# Altium schematic sheet CoG_IHM.SchDoc
size A3; Author: Audran; CompanyName: Goldorak; Address1: Electrolab; Address2: 52 rue Paul Lescop; Address3: 92000 Nanterre; ProjectName: Cartes_2017
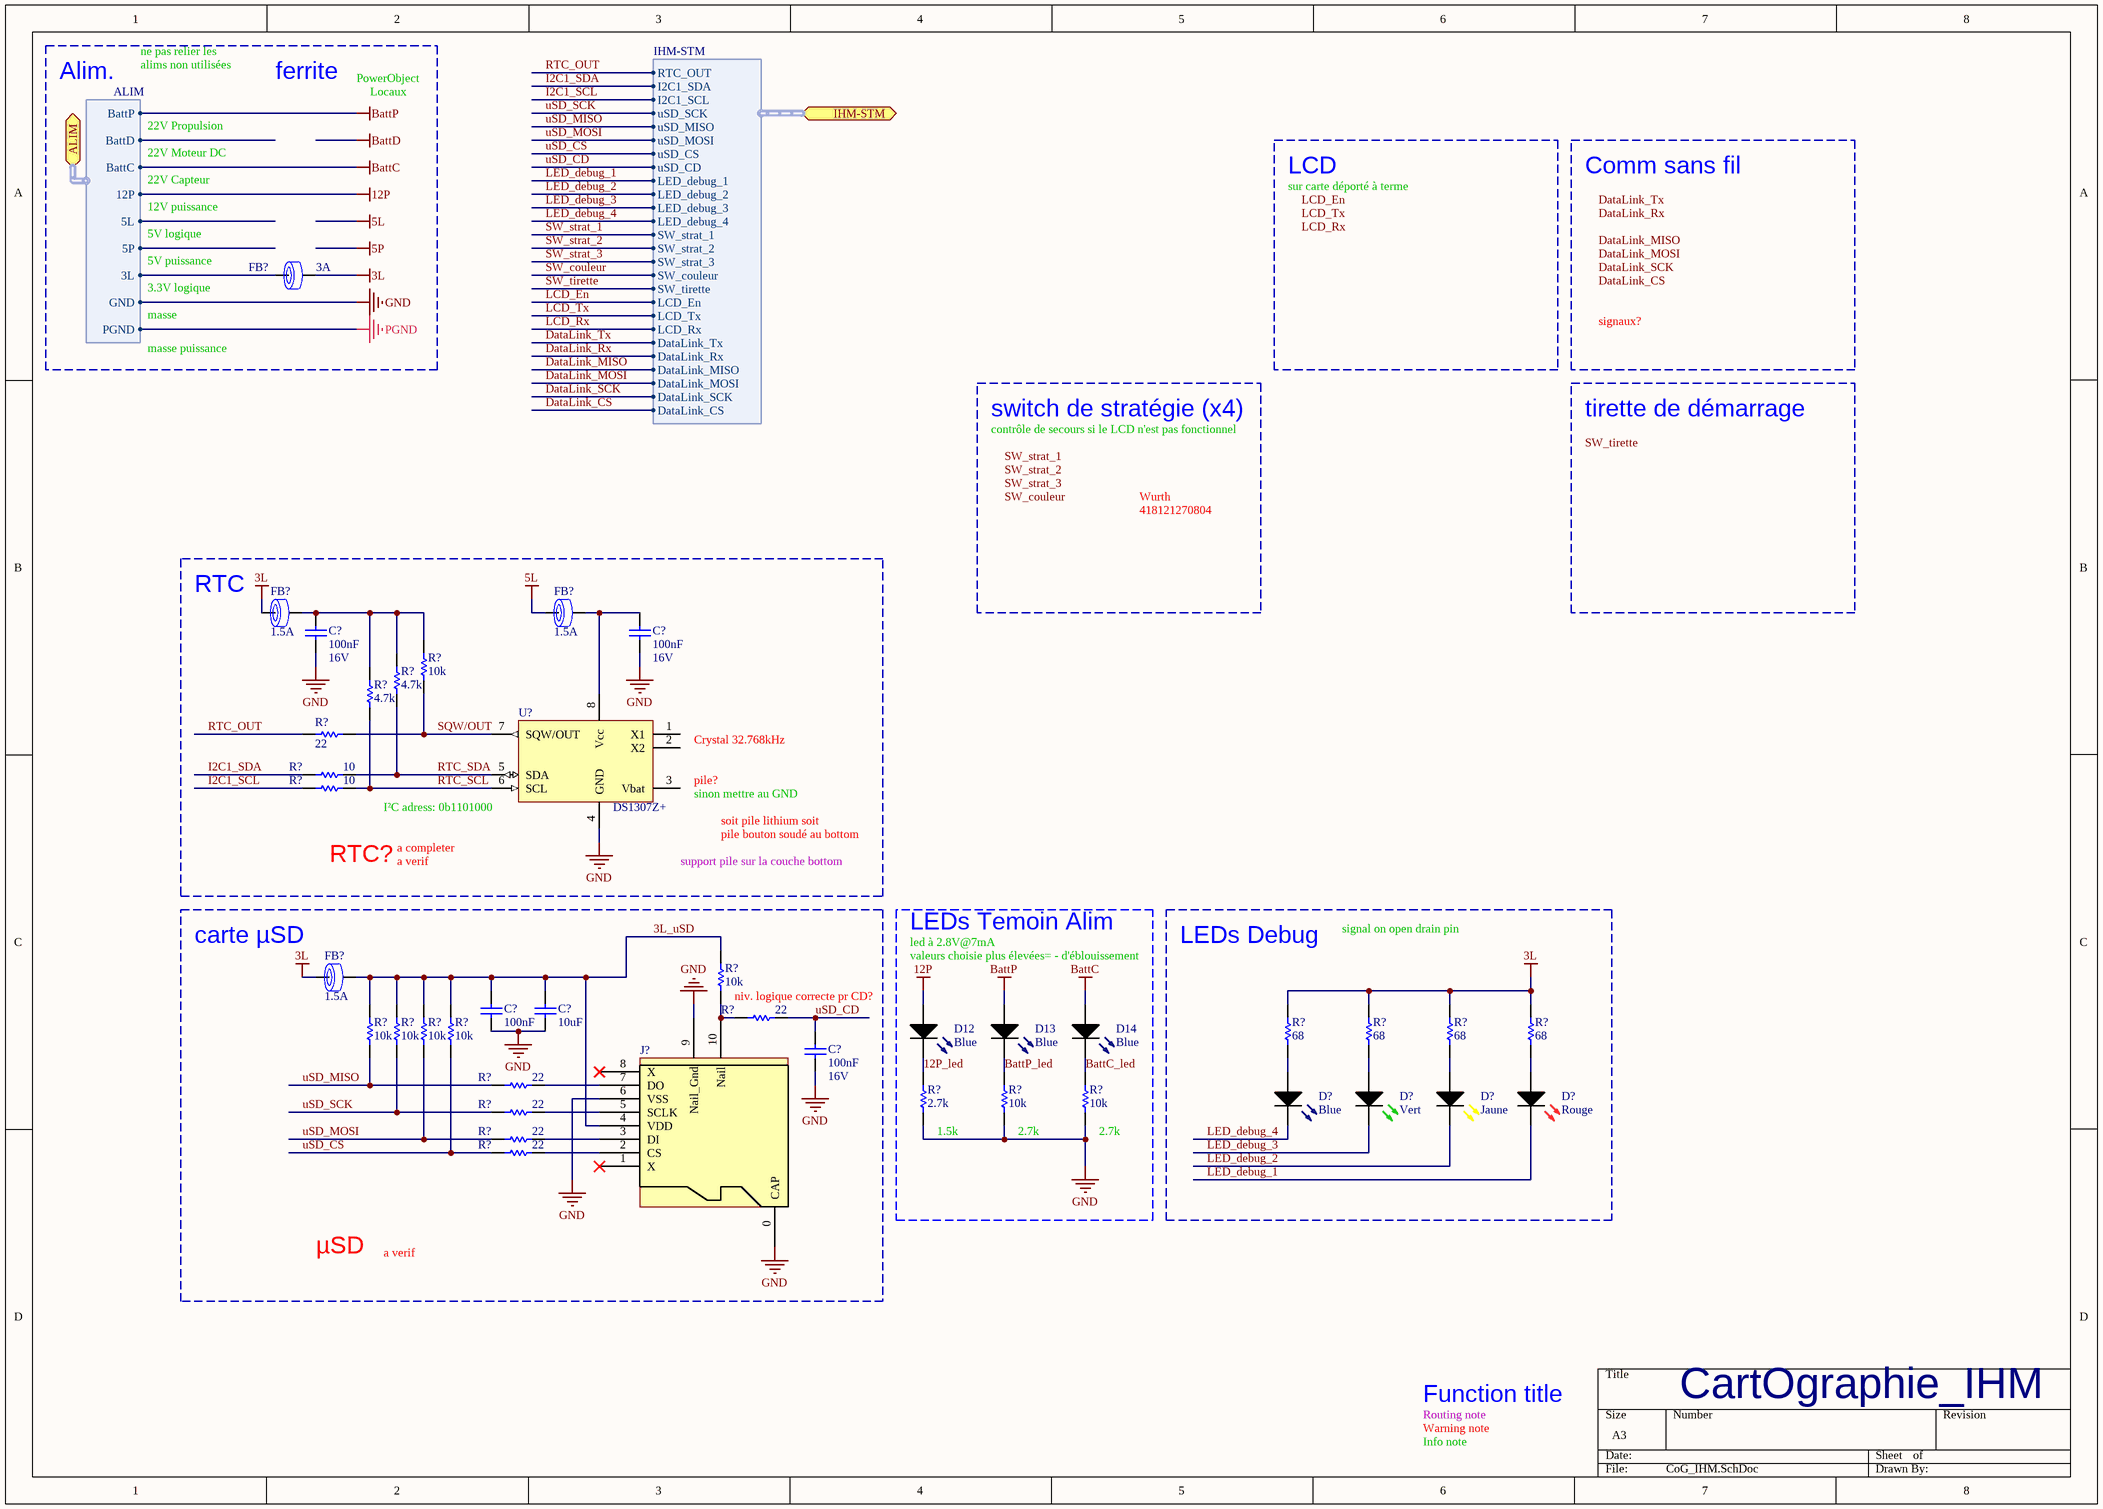
[diagram p0: CoG_IHM.SchDoc]

## Parts
(Parts that share a designator on the sheet are numbered #1, #2 ... from top to bottom, then left to right.)
C?#1  100nF  RatedVoltage: 16V  [WCAP-CSGP_0402, 1x0.5x0.5]
C?#2  100nF  RatedVoltage: 16V  [WCAP-CSGP_0402, 1x0.5x0.5]
C?#3  100nF  [WCAP-CSGP_0402, 1x0.5x0.5]
C?#4  10uF  [WCAP-CSGP_0805, 2x1.25x1.25]
C?#5  100nF  RatedVoltage: 16V  [WCAP-CSGP_0402, 1x0.5x0.5]
D12  Blue  [0603]
D13  Blue  [0603]
D14  Blue  [0603]
D?#1  Blue  [0603]
D?#2  Vert  [0603 - MIXTE]
D?#3  Jaune  [0603]
D?#4  Rouge  [0603]
FB?#1  RatedCurrent: 3A  [WE-CBF_0805_High Current]  (hidden comment: 742792023)
FB?#2  RatedCurrent: 1.5A  [WE-CBF_0603_High Current]  (hidden comment: 742792624)
FB?#3  RatedCurrent: 1.5A  [WE-CBF_0603_High Current]  (hidden comment: 742792624)
FB?#4  RatedCurrent: 1.5A  [WE-CBF_0603_High Current]  (hidden comment: 742792624)
J?  5027740891  [MOLEX_MICRO_SD_HEADER_5027740891]  (value not drawn)
R?#1  value 10k  [RESC1005X04N]  (hidden comment: RC0402FR-0710KL)
R?#2  value 4.7k  [RESC1005X04N]
R?#3  value 4.7k  [RESC1005X04N]
R?#4  value 22  [RESC1005X04N]  (hidden comment: RC0402FR-0722RL)
R?#5  value 10  [RESC1005X04N]  (hidden comment: RC0402FR-0710RL)
R?#6  value 10  [RESC1005X04N]  (hidden comment: RC0402FR-0710RL)
R?#7  value 10k  [RESC1005X04N]  (hidden comment: RC0402FR-0710KL)
R?#8  value 68  [RESC1608X06N]  (hidden comment: RC0603FR-0768RL)
R?#9  value 68  [RESC1608X06N]  (hidden comment: RC0603FR-0768RL)
R?#10  value 68  [RESC1608X06N]  (hidden comment: RC0603FR-0768RL)
R?#11  value 68  [RESC1608X06N]  (hidden comment: RC0603FR-0768RL)
R?#12  value 22  [RESC1005X04N]  (hidden comment: RC0402FR-0722RL)
R?#13  value 10k  [RESC1005X04N]  (hidden comment: RC0402FR-0710KL)
R?#14  value 10k  [RESC1005X04N]  (hidden comment: RC0402FR-0710KL)
R?#15  value 10k  [RESC1005X04N]  (hidden comment: RC0402FR-0710KL)
R?#16  value 10k  [RESC1005X04N]  (hidden comment: RC0402FR-0710KL)
R?#17  value 22  [RESC1005X04N]  (hidden comment: RC0402FR-0722RL)
R?#18  value 22  [RESC1005X04N]  (hidden comment: RC0402FR-0722RL)
R?#19  value 2.7k  [RESC2012X06M]  (hidden comment: RC0805FR-072K7L)
R?#20  value 10k  [RESC1608X06N]  (hidden comment: RC0603FR-0710KL)
R?#21  value 10k  [RESC1608X06N]  (hidden comment: RC0603FR-0710KL)
R?#22  value 22  [RESC1005X04N]  (hidden comment: RC0402FR-0722RL)
R?#23  value 22  [RESC1005X04N]  (hidden comment: RC0402FR-0722RL)
U?  DS1307Z+

## Blocks framed on the sheet
LEDs Temoin Alim: D12-D14 R?#19-R?#21
LEDs Debug: D?#1-D?#4 R?#8-R?#11

## Ports
ALIM (harness ALIM), IHM-STM (harness IHM-STM)

## Harnesses
IHM-STM: RTC_OUT, I2C1_SDA, I2C1_SCL, uSD_SCK, uSD_MISO, uSD_MOSI, uSD_CS, uSD_CD, LED_debug_1, LED_debug_2, LED_debug_3, LED_debug_4, SW_strat_1, SW_strat_2, SW_strat_3, SW_couleur, SW_tirette, LCD_En, LCD_Tx, LCD_Rx, DataLink_Tx, DataLink_Rx, DataLink_MISO, DataLink_SCK, DataLink_MOSI, DataLink_CS
ALIM: BattP, BattD, BattC, 12P, 5L, 5P, 3L, GND, PGND

## Nets
3L: FB?#1.2 FB?#2.1 FB?#4.1 R?#8.1 R?#9.1 R?#10.1 R?#11.1
5L: FB?#3.1
12P: D12.2(A) ; port ALIM.12P
BattC: D14.2(A) ; port ALIM.BattC
BattP: D13.2(A) ; port ALIM.BattP
GND: C?#1.1 C?#2.1 C?#3.1 C?#4.1 C?#5.1 J?.0(CAP) J?.6(VSS) J?.9(Nail_Gnd) R?#19.1 R?#20.1 R?#21.1 U?.4(GND) ; port ALIM.GND
PGND: port ALIM.PGND
3L_uSD: C?#3.2 C?#4.2 FB?#4.2 J?.4(VDD) R?#7.2 R?#13.2 R?#14.2 R?#15.2 R?#16.2
12P_led: D12.1(C) R?#19.2
BattC_led: D14.1(C) R?#21.2
BattP_led: D13.1(C) R?#20.2
DataLink_CS: port IHM-STM.DataLink_CS
DataLink_MISO: port IHM-STM.DataLink_MISO
DataLink_MOSI: port IHM-STM.DataLink_MOSI
DataLink_Rx: port IHM-STM.DataLink_Rx
DataLink_SCK: port IHM-STM.DataLink_SCK
DataLink_Tx: port IHM-STM.DataLink_Tx
I2C1_SCL: R?#6.1 ; port IHM-STM.I2C1_SCL
I2C1_SDA: R?#5.1 ; port IHM-STM.I2C1_SDA
LCD_En: port IHM-STM.LCD_En
LCD_Rx: port IHM-STM.LCD_Rx
LCD_Tx: port IHM-STM.LCD_Tx
LED_debug_1: D?#4.1(C) ; port IHM-STM.LED_debug_1
LED_debug_2: D?#3.1(C) ; port IHM-STM.LED_debug_2
LED_debug_3: D?#2.1(C) ; port IHM-STM.LED_debug_3
LED_debug_4: D?#1.1(C) ; port IHM-STM.LED_debug_4
RTC_OUT: R?#4.1 ; port IHM-STM.RTC_OUT
RTC_SCL: R?#3.1 R?#6.2 U?.6(SCL)
RTC_SDA: R?#2.1 R?#5.2 U?.5(SDA)
SQW/OUT: R?#1.1 R?#4.2 U?.7(SQW/OUT)
SW_couleur: port IHM-STM.SW_couleur
SW_strat_1: port IHM-STM.SW_strat_1
SW_strat_2: port IHM-STM.SW_strat_2
SW_strat_3: port IHM-STM.SW_strat_3
SW_tirette: port IHM-STM.SW_tirette
uSD_CD: C?#5.2 R?#12.2 ; port IHM-STM.uSD_CD
uSD_CS: R?#16.1 R?#23.1 ; port IHM-STM.uSD_CS
uSD_MISO: R?#13.1 R?#17.1 ; port IHM-STM.uSD_MISO
uSD_MOSI: R?#15.1 R?#22.1 ; port IHM-STM.uSD_MOSI
uSD_SCK: R?#14.1 R?#18.1 ; port IHM-STM.uSD_SCK
NetC?#1_2: C?#1.2 FB?#2.2 R?#1.2 R?#2.2 R?#3.2
NetC?#2_2: C?#2.2 FB?#3.2 U?.8(Vcc)
NetD?#1_2: D?#1.2(A) R?#8.2
NetD?#2_2: D?#2.2(A) R?#9.2
NetD?#3_2: D?#3.2(A) R?#10.2
NetD?#4_2: D?#4.2(A) R?#11.2
NetFB?#1_1: FB?#1.1 ; port ALIM.3L
NetJ?_2: J?.2(CS) R?#23.2
NetJ?_3: J?.3(DI) R?#22.2
NetJ?_5: J?.5(SCLK) R?#18.2
NetJ?_7: J?.7(DO) R?#17.2
NetJ?_10: J?.10(Nail) R?#7.1 R?#12.1

Not connected (* = marked no-connect by the designer): J? 1(X)* 8(X)*; U? 1(X1) 2(X2) 3(Vbat)

## Notes on the sheet
- Alim.
- ne pas relier les
- alims non utilisées
- ferrite
- PowerObject
- Locaux
- 22V Propulsion
- 22V Moteur DC
- 22V Capteur
- LCD
- Comm sans fil
- 5V logique
- 12V puissance
- sur carte déporté à terme
- 5V puissance
- 3.3V logique
- masse
- masse puissance
- signaux?
- switch de stratégie (x4)
- contrôle de secours si le LCD n'est pas fonctionnel
- tirette de démarrage
- 418121270804
- Wurth
- (near FB?#2) RTC
- (near U?) Crystal 32.768kHz
- (near U?) pile?
- (near U?) I²C adress: 0b1101000
- a completer
- (near U?) sinon mettre au GND
- soit pile lithium soit
- pile bouton soudé au bottom
- RTC?
- a verif
- support pile sur la couche bottom
- (near FB?#4) carte µSD
- led à 2.8V@7mA
- valeurs choisie plus élevées= - d'éblouissement
- signal on open drain pin
- (near R?#7) niv. logique correcte pr CD?
- (near R?#19) 1.5k
- (near R?#20) 2.7k
- (near R?#21) 2.7k
- µSD
- Routing note
- Warning note
- Info note
- Function title
- CartOgraphie_IHM
- Labels drawn without touching a wire or pin: DataLink_CS, DataLink_MISO, DataLink_MOSI, DataLink_Rx, DataLink_SCK, DataLink_Tx, LCD_En, LCD_Rx, LCD_Tx, SW_couleur, SW_strat_1, SW_strat_2, SW_strat_3, SW_tirette

## Library data of the parts
C?#1-C?#3 C?#5 = WCAP-CSGP, 885012205037: CAP CER 100nF 16V X7R 0402; Manufacturer: Wurth Elektronik; PublishedDate: Aug 2016; ComponentLink1Description: Manufacturer; ComponentLink1URL: http://www.we-online.de; ComponentLink2Description: Datasheet; ComponentLink2URL: http://katalog.we-online.com/pbs/datasheet/885012205037.pdf; Value: 100nF; Size: 0402; CeramicType: X7R; Manufacturer Part Number: 885012205037
  C?#3: RatedVoltage: 16V
C?#4 = WCAP-CSGP, 885012207026: CAP CER 10uF 10V X7R 0805; Manufacturer: Wurth Elektronik; PublishedDate: Aug 2016; ComponentLink1Description: Manufacturer; ComponentLink1URL: http://www.we-online.de; ComponentLink2Description: Datasheet; ComponentLink2URL: http://katalog.we-online.com/pbs/datasheet/885012207026.pdf; Manufacturer Part Number: 885012207026; Value: 10uF; Size: 0805; CeramicType: X7R; RatedVoltage: 10V
D12-D14 D?#1 = WL-SMCW 0603  150060BS75000: SMD mono-color Chip LED, WL-SMCW, Blue; Manufacturer 1: Würth Elektronik eiSos GmbH; Manufacturer Part Number: 150060BS75000; ComponentLink1Description: Manufacturer; ComponentLink1URL: http://www.we-online.de; Created by: Christin Otto; Created Date: June 2013; ComponentLink2Description: Datasheet; ComponentLink2URL: http://katalog.we-online.com/led/datasheet/150060BS75000.pdf; Color: Blue; Value: Blue; Supplier 1: Farnell; Supplier Part Number 1: 2322069
D?#2 = WL-SMCW 0603  150060GS75000: SMD mono-color Chip LED, WL-SMCW, Green; Manufacturer 1: Würth Elektronik eiSos GmbH; Manufacturer Part Number: 150060GS75000; ComponentLink1Description: Manufacturer; ComponentLink1URL: http://www.we-online.de; Created by: Christin Otto; Created Date: June 2013; ComponentLink2Description: Datasheet; ComponentLink2URL: http://katalog.we-online.com/led/datasheet/150060GS75000.pdf; Color: Green; Value: Vert; Supplier 1: Farnell; Supplier Part Number 1: 2322070
D?#3 = WL-SMCW 0603  150060YS75000: SMD mono-color Chip LED, WL-SMCW, Yellow; Manufacturer 1: Würth Elektronik eiSos GmbH; Manufacturer Part Number: 150060YS75000; ComponentLink1Description: Manufacturer; ComponentLink1URL: http://www.we-online.de; Created by: Christin Otto; Created Date: June 2013; ComponentLink2Description: Datasheet; ComponentLink2URL: http://katalog.we-online.com/led/datasheet/150060YS75000.pdf; Color: Yellow; Value: Jaune; Supplier 1: Farnell; Supplier Part Number 1: 2322074
D?#4 = WL-SMCW 0603  150060RS75000: SMD mono-color Chip LED, WL-SMCW, Red; Manufacturer 1: Würth Elektronik eiSos GmbH; Manufacturer Part Number: 150060RS75000; ComponentLink1Description: Manufacturer; ComponentLink1URL: http://www.we-online.de; Created by: Christin Otto; Created Date: June 2013; ComponentLink2Description: Datasheet; ComponentLink2URL: http://katalog.we-online.com/led/datasheet/150060RS75000.pdf; Color: Red; Value: Rouge; Supplier 1: Farnell; Supplier Part Number 1: 2322071
FB?#1 = WE-CBF, 742792023: Ferrite Bead 120ohm 0805 max3.0A; Manufacturer: Wurth Elektronik; Value: 120Ω; Type: High Current; PublishedDate: Aug 2016; ComponentLink1Description: Manufacturer; ComponentLink1URL: http://www.we-online.de; ComponentLink2Description: Datasheet; ComponentLink2URL: http://katalog.we-online.de/pbs/datasheet/742792023.pdf; Manufacturer Part Number: 742792023; Size: 0805
FB?#2-FB?#4 = WE-CBF, 742792624: Ferrite Bead 180ohm 0603 max1.5A; Manufacturer: Wurth Elektronik; Value: 180Ω; Type: High Current; PublishedDate: Aug 2016; ComponentLink1Description: Manufacturer; ComponentLink1URL: http://www.we-online.de; ComponentLink2Description: Datasheet; ComponentLink2URL: http://katalog.we-online.de/pbs/datasheet/742792624.pdf; Manufacturer Part Number: 742792624; Size: 0603
J? = 5027740891: CONN MICRO SD CARD PUSH-PUSH R/A; Manufacturer: Molex, LLC; Manufacturer Part Number: 5027740891; ComponentLink1URL: http://www.molex.com/pdm_docs/ps/PS-502774-001.pdf; ComponentLink1Description: http://www.molex.com/pdm_docs/ps/PS-502774-001.pdf; Supplier 1: Farnell; Supplier Part Number 1: 2064063
R?#1 R?#7 R?#13-R?#16 = RC0402FR-0710KL: RES SMD 10K OHM 1% 1/16W 0402; Manufacturer: Yageo; Power: 63mW; Vmax: 50V; Type: Thick Film; ComponentLink1Description: Manufacturer; ComponentLink1URL: http://www.yageo.com/NewPortal/_en/index.jsp; ComponentLink2Description: Datasheet; ComponentLink2URL: http://www.farnell.com/datasheets/2167052.pdf; Supplier 1: Farnell; Supplier Part Number 1: 9239359; Manufacturer Part Number: RC0402FR-0710KL; Precision: ±1%
R?#2 R?#3 = RC0402FR-074K7L: RES SMD 4K7 OHM 1% 1/16W 0402; Manufacturer: Yageo; Power: 63mW; Vmax: 50V; Type: Thick Film; ComponentLink1Description: Manufacturer; ComponentLink1URL: http://www.yageo.com/NewPortal/_en/index.jsp; ComponentLink2Description: Datasheet; ComponentLink2URL: http://www.farnell.com/datasheets/2167052.pdf; Manufacturer Part Number: RC0402FR-074K7L; Supplier 1: Farnell; Supplier Part Number 1: 9239316; Precision: ±1%
R?#4 R?#12 R?#17 R?#18 R?#22 R?#23 = RC0402FR-0722RL: RES SMD 22 OHM 1% 1/16W 0402; Manufacturer: Yageo; Power: 63mW; Vmax: 50V; Type: Thick Film; ComponentLink1Description: Manufacturer; ComponentLink1URL: http://www.yageo.com/NewPortal/_en/index.jsp; ComponentLink2Description: Datasheet; ComponentLink2URL: http://www.farnell.com/datasheets/2167052.pdf; Manufacturer Part Number: RC0402FR-0722RL; Supplier 1: Farnell; Supplier Part Number 1: 9239030; Precision: ±1%
R?#5 R?#6 = RC0402FR-0710RL: RES SMD 10 OHM 1% 1/16W 0402; Manufacturer: Yageo; Power: 63mW; Vmax: 50V; Type: Thick Film; ComponentLink1Description: Manufacturer; ComponentLink1URL: http://www.yageo.com/NewPortal/_en/index.jsp; ComponentLink2Description: Datasheet; ComponentLink2URL: http://www.farnell.com/datasheets/1018594.pdf; Manufacturer Part Number: RC0402FR-0710RL; Supplier 1: Farnell; Supplier Part Number 1: 9238999; Precision: ±1%
R?#8-R?#11 = RC0603FR-0768RL: RES SMD 68 OHM 1% 1/10W 0603; Manufacturer: Yageo; Power: 100mW; Vmax: 50V; Manufacturer Part Number: RC0603FR-0768RL; Type: Thick Film; ComponentLink1Description: Manufacturer; ComponentLink1URL: http://www.yageo.com/NewPortal/_en/index.jsp; ComponentLink2Description: Datasheet; ComponentLink2URL: http://www.farnell.com/datasheets/1868787.pdf; Supplier 1: Farnell; Supplier Part Number 1: 9238344; Precision: ±1%
R?#19 = RC0805FR-072K7L: RES SMD 2K7 OHM 1% 1/8W 0805; Manufacturer: Yageo; Power: 125mW; Vmax: 50V; Manufacturer Part Number: RC0805FR-072K7L; Type: Thick Film; ComponentLink1Description: Manufacturer; ComponentLink1URL: http://www.yageo.com/NewPortal/_en/index.jsp; ComponentLink2Description: Datasheet; ComponentLink2URL: http://www.farnell.com/datasheets/444164.pdf; Supplier 1: Farnell; Supplier Part Number 1: 9237666; Precision: ±1%
R?#20 R?#21 = RC0603FR-0710KL: RES SMD 10K OHM 1% 1/10W 0603; Manufacturer: Yageo; Power: 100mW; Vmax: 50V; Manufacturer Part Number: RC0603FR-0710KL; Type: Thick Film; ComponentLink1Description: Manufacturer; ComponentLink1URL: http://www.yageo.com/NewPortal/_en/index.jsp; ComponentLink2Description: Datasheet; ComponentLink2URL: http://www.farnell.com/datasheets/2167052.pdf; Supplier 1: Farnell; Supplier Part Number 1: 9238603; Precision: ±1%
U? = DS1307Z+: IC RTC CLK/CALENDAR I2C 8-SOIC; Manufacturer: Maxim Integrated; Manufacturer Part Number: DS1307Z+; ComponentLink1URL: http://datasheets.maximintegrated.com/en/ds/DS1307.pdf; ComponentLink1Description: datasheet; Supplier 1: Digi-Key; Supplier Part Number 1: DS1307Z+-ND